# EAGLE schematic lo_sec_subsystem (EAGLE 9.6.1)
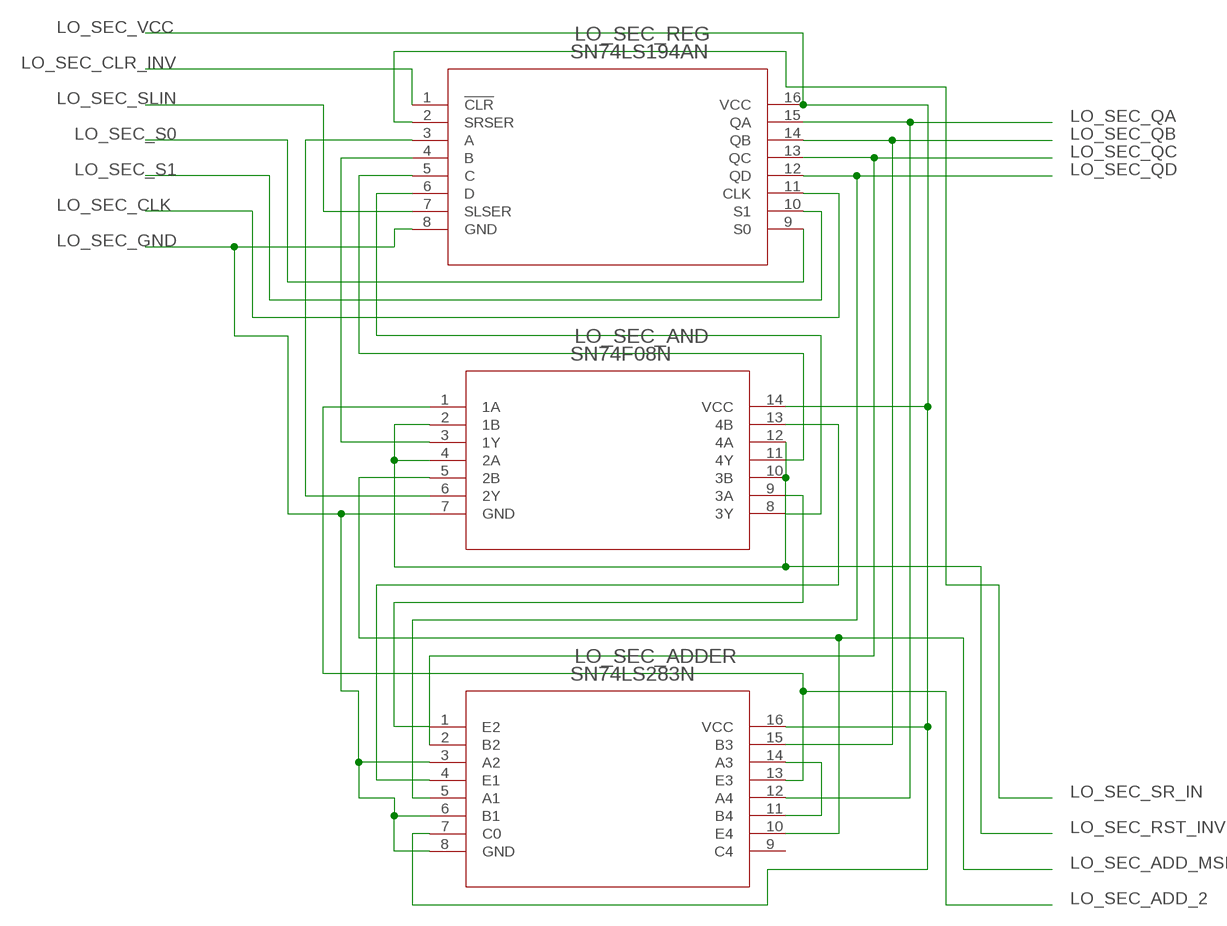
[diagram p0: schematic, sheet 1]

## Parts
LO_SEC_ADDER  SN74LS283N  [N16]
LO_SEC_AND  SN74F08N  [N14]
LO_SEC_REG  SN74LS194AN  [N16]

## Nets
LO_SEC_ADD_1: LO_SEC_ADDER.1(E2) LO_SEC_AND.9(3A)
LO_SEC_ADD_2: LO_SEC_ADDER.13(E3) LO_SEC_AND.1(1A)
LO_SEC_ADD_MSB: LO_SEC_ADDER.10(E4) LO_SEC_AND.5(2B)
LO_SEC_CLK: LO_SEC_REG.11(CLK)
LO_SEC_CLR_INV: LO_SEC_REG.1(!CLR)
LO_SEC_GND: LO_SEC_ADDER.3(A2) LO_SEC_ADDER.6(B1) LO_SEC_ADDER.8(GND) LO_SEC_AND.7(GND) LO_SEC_REG.8(GND)
LO_SEC_QA: LO_SEC_ADDER.12(A4) LO_SEC_REG.15(QA)
LO_SEC_QB: LO_SEC_ADDER.15(B3) LO_SEC_REG.14(QB)
LO_SEC_QC: LO_SEC_ADDER.2(B2) LO_SEC_REG.13(QC)
LO_SEC_QD: LO_SEC_ADDER.5(A1) LO_SEC_REG.12(QD)
LO_SEC_RST_INV: LO_SEC_AND.2(1B) LO_SEC_AND.4(2A) LO_SEC_AND.10(3B) LO_SEC_AND.12(4A)
LO_SEC_S0: LO_SEC_REG.9(S0)
LO_SEC_S1: LO_SEC_REG.10(S1)
LO_SEC_SLIN: LO_SEC_REG.7(SLSER)
LO_SEC_SR_IN: LO_SEC_REG.2(SRSER)
LO_SEC_VCC: LO_SEC_ADDER.7(C0) LO_SEC_ADDER.16(VCC) LO_SEC_AND.14(VCC) LO_SEC_REG.16(VCC)
N$1: LO_SEC_AND.6(2Y) LO_SEC_REG.3(A)
N$2: LO_SEC_AND.3(1Y) LO_SEC_REG.4(B)
N$3: LO_SEC_AND.11(4Y) LO_SEC_REG.5(C)
N$4: LO_SEC_AND.8(3Y) LO_SEC_REG.6(D)
N$5: LO_SEC_ADDER.4(E1) LO_SEC_AND.13(4B)
N$14: LO_SEC_ADDER.11(B4) LO_SEC_ADDER.14(A3)
Unconnected: LO_SEC_ADDER.9(C4)

## Library data of the parts
LO_SEC_ADDER = sn74ls283n:SN74LS283N: 4-Bit Full Adder w/ Fast Carry; DATASHEET_URL: http://www.ti.com/lit/gpn/SN74LS283; DESCRIPTION: 4-Bit Binary Full Adders With Fast Carry; FAMILY_NAME: ADDER; GENERIC_PART_NUMBER: SN74LS283; INDUSTRY_STD_PKG_TYPE: PDIP; MANUFACTURER: Texas Instruments; PACKAGE_DESIGNATOR: N; PIN_COUNT: 16
LO_SEC_AND = sn74f08n:SN74F08N: Quad 2-In Positive AND; DATASHEET_URL: http://www.ti.com/lit/gpn/SN74F08; DESCRIPTION: Quadruple 2-Input Positive-AND Gate; FAMILY_NAME: AND GATE; GENERIC_PART_NUMBER: SN74F08; INDUSTRY_STD_PKG_TYPE: PDIP; MANUFACTURER: Texas Instruments; PACKAGE_DESIGNATOR: N; PIN_COUNT: 14
LO_SEC_REG = sn74ls194an:SN74LS194AN: 4-Bit BiDir. Universal Shift Register; DATASHEET_URL: http://www.ti.com/lit/gpn/SN74LS194A; DESCRIPTION: Bidirectional universal shift registers; FAMILY_NAME: SHIFT REGISTER; GENERIC_PART_NUMBER: SN74LS194A; INDUSTRY_STD_PKG_TYPE: PDIP; MANUFACTURER: Texas Instruments; PACKAGE_DESIGNATOR: N; PIN_COUNT: 16